# Altium project SrdceDPS.PrjPcb
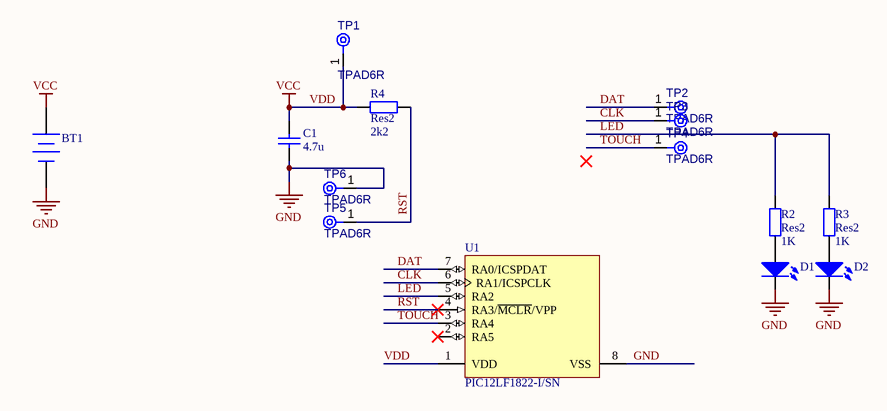
[diagram p0: Schematic.SchDoc]
1 sheet, 14 parts. Net scope: global (net labels, ports and power ports of the same name join across sheets).
Board file: PCB.PcbDoc

## Sheet Schematic.SchDoc: Touch Sensitive Heart Keychain
size A4; PageSetup: Record=PageOptions|CenterHorizontal=True|CenterVertical=True|PrintScale=1.09|XCorrection=1.00|YCorrection=1.00|PrintKind=0|BorderSize=5000000|LeftOffset=0|BottomOffset=0|Orientation=2|PaperLength=1000|PaperWidth=1000|Scale=100|PaperSource=7|PrintQuality=-3|MediaType=1|DitherType=10|PrintScaleMode=1|PaperKind=A4|PaperIndex=9; URL: http://sasakaranovic.com/projects/diy-heart-keychain/

### Parts
BT1  Battery  [CR2032 SMD]  (value not drawn)
C1  value 4.7u  [0603 - CAP]  (hidden comment: Cap)
D1  LED  [0805 -  LED]  (value not drawn)
D2  LED  [0805 -  LED]  (value not drawn)
R2  Res2  value 1K  [C1206]
R3  Res2  value 1K  [C1206]
R4  Res2  value 2k2  [C1206]
TP1  TPAD6R  [TP06R]  (no BOM)
TP2  TPAD6R  [TP06R]  (no BOM)
TP3  TPAD6R  [TP06R]  (no BOM)
TP4  TPAD6R  [TP06R]  (no BOM)
TP5  TPAD6R  [TP06R]  (no BOM)
TP6  TPAD6R  [TP06R]  (no BOM)
U1  PIC12LF1822-I/SN  [MCHP-SOIC-SN8_N]

### Nets
GND: BT1.2(-) C1.1 D1.K D2.K TP6.1(TP) U1.8(VSS)
VDD: BT1.1(+) C1.2 R4.2 TP1.1(TP) U1.1(VDD)  [also labelled VCC]
CLK: TP3.1(TP) U1.6(RA1/ICSPCLK)
DAT: TP2.1(TP) U1.7(RA0/ICSPDAT)
LED: R2.2 R3.2 U1.5(RA2)
RST: R4.1 TP5.1(TP) U1.4(RA3/~{MCLR}/VPP)
TOUCH: TP4.1(TP) U1.3(RA4)
NetD1_A: D1.A R2.1
NetD2_A: D2.A R3.1

Not connected (* = marked no-connect by the designer): U1 2(RA5)*

### Notes on the sheet
- sasakaranovic.com/youtube
- sasakaranovic.com
- sasakaranovic.com/github
- sasakaranovic.com/facebook
- sasakaranovic.com/twitter
- sasakaranovic.com/linkedin

### Library data of the parts
BT1 = Battery: Multicell Battery; Published: 24-Mar-1999; LatestRevisionDate: 17-Jul-2002; LatestRevisionNote: Re-released for DXP Platform.; PackageReference: BAT-2; Publisher: Altium Limited; PackageDescription: Battery; 2 Leads; Distributor: Digikey; Distributor PN: BAT-HLD-002-SMT-ND
C1 = Cap: Capacitor; Published: 8-Jun-2000; LatestRevisionDate: 17-Jul-2002; LatestRevisionNote: Re-released for DXP Platform.; PackageReference: RAD-0.3; Publisher: Altium Limited; PackageDescription: Radial Cap, Thru-Hole; 2 Leads; 0.3 in Pin Spacing; Distributor: Digikey; Distributor PN: 1276-2087-1-ND
D1 D2 = LED: Typical RED GaAs LED; Published: 8-Jun-2000; LatestRevisionDate: 08-Jul-2005; LatestRevisionNote: Mech Layer 1 removed.; PackageReference: LED-1; Publisher: Altium Limited; PackageDescription: LED; 2 Leads; Supplier 1: Digi-Key; Distributor: Digikey; Distributor PN: 475-1278-1-ND
  D1: Supplier Part Number 2: 475-1278-1-ND
  D2: Supplier Part Number 1: 475-1278-1-ND
R2-R4 = Res2: Resistor; Published: 8-Jun-2000; LatestRevisionDate: 17-Jul-2002; LatestRevisionNote: Re-released for DXP Platform.; PackageReference: AXIAL-0.4; Publisher: Altium Limited; PackageDescription: Axial Device, Thru-Hole; 2 Leads; 0.4 in Pin Spacing
TP1-TP6 = CMP-00028-00002-1: 0.6mm round; Pins: 1
U1 = CMP-0190-00405-1: Flash Microcontroller with XLP Technology, 32 MHz, 5 I/O, -40 to 85 degC, 8-pin SOIC (SN8), Tube; Manufacturer: Microchip; Internal Oscillator: 32 MHz, 31 kHz; # of A/D Channels: 4; Digital Communication: 1 -A/E/USART, 1 -MSSP(SPI/I2C); EEPROM Data Memory (bytes): 256; I/O Pins: 5; Operation Voltage Range: 1.8V - 3.6V; Program Memory KBytes: 3.5; Max. CPU Speed MHz: 32; Program Memory KWords: 2; RAM: 128; Timers: 2 - 8-bit, 1 - 16-bit, 0 - 32-bit; ComponentLink3URL: Product URL:http://www.microchip.com/datasheet/PIC12F1822; ComponentLink1URL: http://ww1.microchip.com/downloads/en/DeviceDoc/41413C.pdf; DatasheetVersion: Rev. C; ComponentLink1Description: Datasheet; PackageReference: SOIC-SN8; PackageDescription: 8-Lead Plastic Small Outline, 4.9 x 3.9 mm Body, 1.27 mm Pitch; Memory Type: Flash; Mounting Technology: Surface Mount; ComponentLink2Description: Package Specification; PackageVersion: C04-057C, 12/2012; ComponentLink3Description: URL Link1; Packing: TUBE; PartNumber: PIC12LF1822-I/SN; ComponentLink2URL: http://www.microchip.com/stellent/groups/techpub_sg/documents/packagingspec/en012702.pdf

## Assembly variants
SOIC: not fitted U1